# Altium schematic sheet LiPo Recharging Circuit Schematic v.20.SchDoc
size A; SheetNumber: 3; SheetTotal: 3
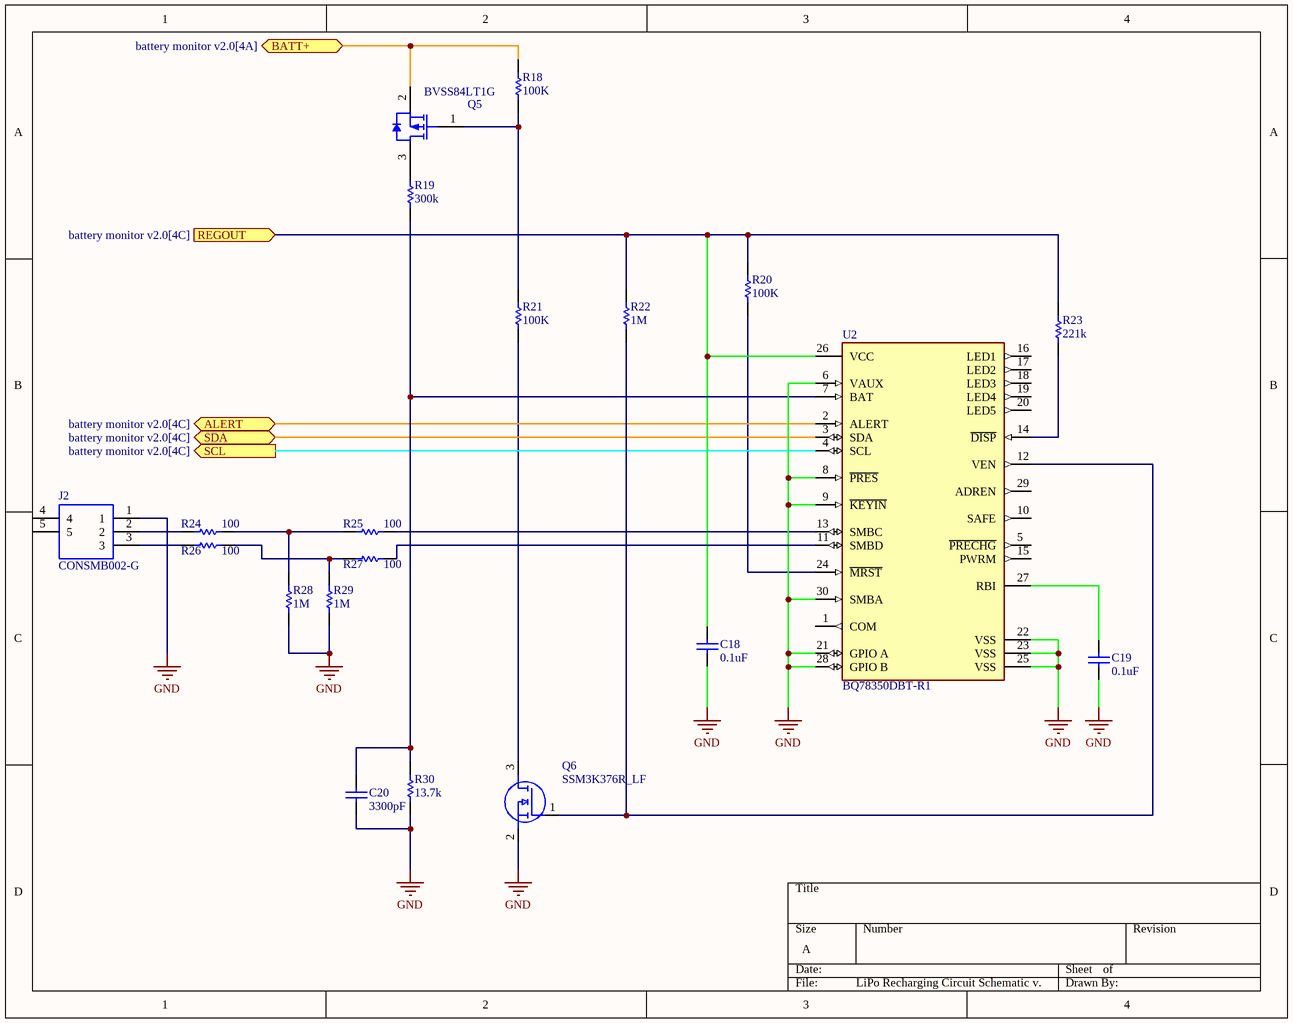
[diagram p0: LiPo Recharging Circuit Schematic v.20.SchDoc]

## Parts
C18  value 0.1uF  [CAPC2012X145N]  (hidden comment: Capacitor)
C19  value 0.1uF  [CAPC2012X145N]  (hidden comment: Capacitor)
C20  value 3300pF  [CAPC2012X145N]  (hidden comment: Capacitor)
J2  CONSMB002-G  [CONSMB002G]
Q5  BVSS84LT1G  [ONSC-SOT-23-3-318-08_V]
Q6  SSM3K376R_LF  [SSM3K376RLF]
R18  value 100K  [CAPC2012X145N]  (hidden comment: Resistor)
R19  value 300k  [CAPC2012X145N]  (hidden comment: Resistor)
R20  value 100K  [CAPC2012X145N]  (hidden comment: Resistor)
R21  value 100K  [CAPC2012X145N]  (hidden comment: Resistor)
R22  value 1M  [CAPC2012X145N]  (hidden comment: Resistor)
R23  value 221k  [CAPC2012X145N]  (hidden comment: Resistor)
R24  value 100  [CAPC2012X145N]  (hidden comment: Resistor)
R25  value 100  [CAPC2012X145N]  (hidden comment: Resistor)
R26  value 100  [CAPC2012X145N]  (hidden comment: Resistor)
R27  value 100  [CAPC2012X145N]  (hidden comment: Resistor)
R28  value 1M  [CAPC2012X145N]  (hidden comment: Resistor)
R29  value 1M  [CAPC2012X145N]  (hidden comment: Resistor)
R30  value 13.7k  [CAPC2012X145N]  (hidden comment: Resistor)
U2  BQ78350DBT-R1  [FP-DBT0030A-IPC_C]

## Ports
ALERT (bidir, see battery monitor v2.0[4C]), BATT+ (bidir, see battery monitor v2.0[4A]), REGOUT (in, see battery monitor v2.0[4C]), SCL (out, see battery monitor v2.0[4C]), SDA (bidir, see battery monitor v2.0[4C])

## Nets
GND: C18.1 C19.1 C20.1 J2.1 Q6.2(S) R28.2 R29.1 R30.1 U2.6(VAUX) U2.8(~{PRES}) U2.9(~{KEYIN}) U2.21(GPIO_A) U2.22(VSS) U2.23(VSS) U2.25(VSS) U2.28(GPIO_B) U2.30(SMBA)
ALERT: U2.2(ALERT) ; port ALERT
BATT+: Q5.2(S) R18.2 ; port BATT+
REGOUT: C18.2 R20.2 R22.2 R23.2 U2.26(VCC) ; port REGOUT
SCL: U2.4(SCL) ; port SCL
SDA: U2.3(SDA) ; port SDA
NetC19_2: C19.2 U2.27(RBI)
NetC20_2: C20.2 R19.1 R30.2 U2.7(BAT)
NetJ2_2: J2.2 R24.2
NetJ2_3: J2.3 R26.2
NetQ5_1: Q5.1(G) R18.1 R21.2
NetQ5_3: Q5.3(D) R19.2
NetQ6_1: Q6.1(G) R22.1 U2.12(VEN)
NetQ6_3: Q6.3(D) R21.1
NetR20_1: R20.1 U2.24(~{MRST})
NetR23_1: R23.1 U2.14(~{DISP})
NetR24_1: R24.1 R25.2 R28.1
NetR25_1: R25.1 U2.13(SMBC)
NetR26_1: R26.1 R27.2 R29.2
NetR27_1: R27.1 U2.11(SMBD)

Not connected (* = marked no-connect by the designer): J2 4 5; U2 1(COM) 5(~{PRECHG}) 10(SAFE) 15(PWRM) 16(LED1) 17(LED2) 18(LED3) 19(LED4) 20(LED5) 29(ADREN)

## Library data of the parts
C18-C20 = Capacitor: SimulationGenericComponent: True
J2 = CONSMB002-G: RF Connectors / Coaxial Connectors SMB Connector Jack, Male Pin 50Ohm Through Hole, Right Angle Solder; Manufacturer_Name: Linx Technologies; Geometry.Height: 9.06mm; Mouser Part Number: 712-CONSMB002-G; Mouser Price/Stock: https://www.mouser.co.uk/ProductDetail/Linx-Technologies/CONSMB002-G?qs=81r%252BiQLm7BTBSU%252Bp%2F%252BRRfQ%3D%3D; Manufacturer_Part_Number: CONSMB002-G; Datasheet Link: https://www.mouser.de/datasheet/2/238/consmb002_g_ds-1929631.pdf
Q5 = CMP-1058-00764-1: Power MOSFET Single P-Channel, -50 V, 10 Ohm, 3-Pin SOT-23, Pb-Free, Tape and Reel; Manufacturer: On Semiconductor; VGS Max (V): 20; Crss Typ (pF): 6.5; Channel Polarity: P Channel; Coss Typ (pF): 17; VGS(th) Max (V): 2; PD Max (W): 0.225; V(BR)DSS Min (V): 50; ID Max (A): 0.13; Ciss Typ (pF): 36; PackageDescription: 3-Pin Small Outline Transistor, Body 2.92 x 1.3 mm, Pitch 0.95 mm; Mounting Technology: Surface Mount; ComponentLink2Description: Datasheet; ComponentLink1Description: Manufacturer URL; RoHS: Pb-Free; ComponentLink2URL: http://www.onsemi.com/pub_link/Collateral/BSS84LT1-D.PDF; Package Type: SOT-23-3; PackageReference: SOT-23-3-318-08; ComponentLink3URL: http://www.onsemi.cn/pub_link/Collateral/318-08.PDF; ComponentLink3Description: Package Specification; Configuration: Single; PackageVersion: Rev. AP, 11/2009; ComponentLink1URL: http://www.onsemi.com/; DatasheetVersion: Rev. 8; PartNumber: BVSS84LT1G; Packing: Tape and Reel
Q6 = SSM3K376R_LF: Trans MOSFET N-CH Si 30V 4A Automotive 3-Pin SOT-23F T/R; Manufacturer_Name: Toshiba; Manufacturer_Part_Number: SSM3K376R,LF; Geometry.Height: 0.88mm; Mouser Part Number: 757-SSM3K376RLF; Mouser Price/Stock: https://www.mouser.co.uk/ProductDetail/Toshiba/SSM3K376RLF?qs=wUXugUrL1qxQI6AhpkM3mw%3D%3D; Datasheet Link: https://toshiba.semicon-storage.com/info/docget.jsp?did=60463&prodName=SSM3K376R
R18-R30 = Resistor: TC1: 0; SimulationGenericComponent: True; TC2: 0
U2 = CMP-04911-000039-1: IC BATTERY MGMT CTRLR 30TSSOP; Max Supply Voltage: 2.6V; Fault Protection: Over Current; Min Supply Voltage: 2.4V; Interface: SMBus; Output Voltage: 5.5V; Mount: Surface Mount; Min Operating Temperature: -40°C; Number of Pins: 30; Contact Plating: Gold; REACH SVHC: No SVHC; Lead Free: Lead Free; Case/Package: TSSOP; Max Operating Temperature: 85°C; Packaging: Rail/Tube; RoHS Compliant: Yes